# EAGLE design Battery_V2 (EAGLE 6.4)
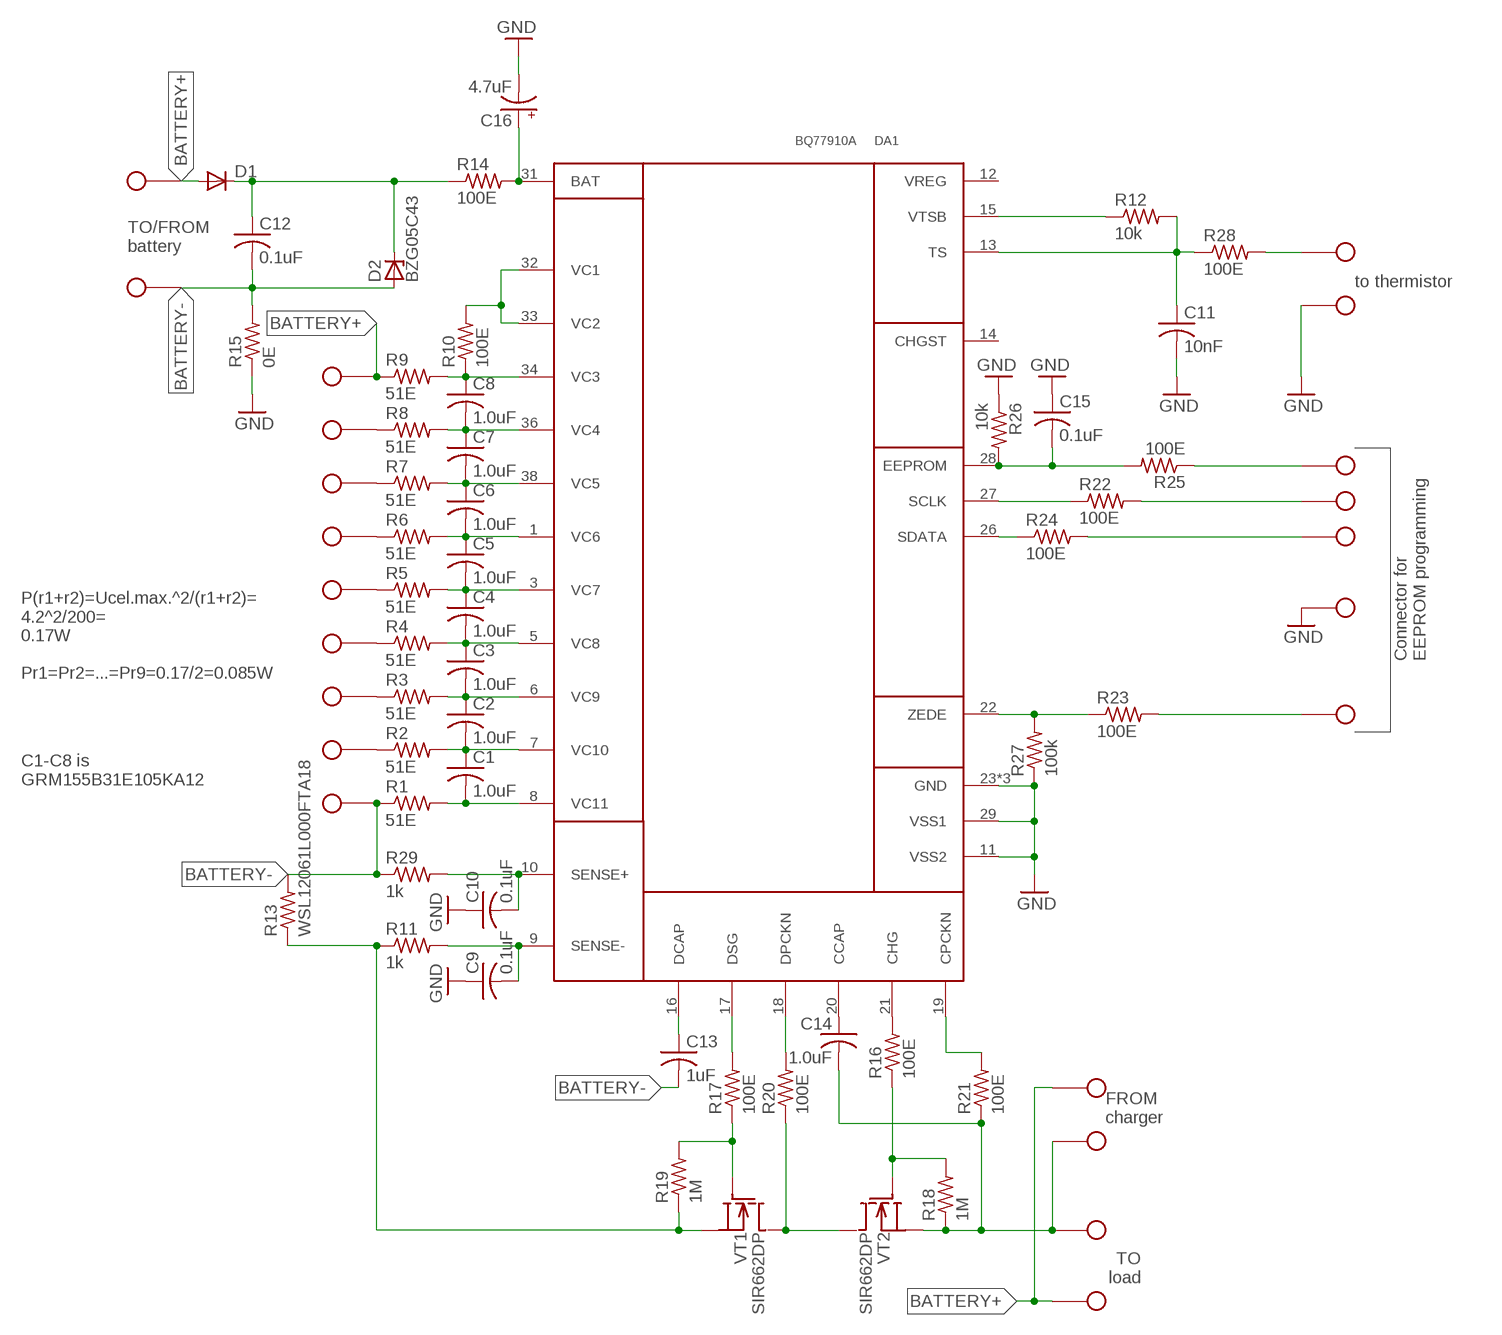
[diagram p0: schematic, sheet 1]

## Parts
C1  1.0uF  C-USC0402K  [C0402K]
C2  1.0uF  C-USC0402K  [C0402K]
C3  1.0uF  C-USC0402K  [C0402K]
C4  1.0uF  C-USC0402K  [C0402K]
C5  1.0uF  C-USC0402K  [C0402K]
C6  1.0uF  C-USC0402K  [C0402K]
C7  1.0uF  C-USC0402K  [C0402K]
C8  1.0uF  C-USC0402K  [C0402K]
C9  0.1uF  C-USC0201  [C0201]
C10  0.1uF  C-USC0201  [C0201]
C11  10nF  C-USC0201  [C0201]
C12  0.1uF  C-USC0402K  [C0402K]
C13  1uF  C-USC0402K  [C0402K]
C14  1.0uF  C-USC0603K  [C0603K]
C15  0.1uF  C-USC0402K  [C0402K]
C16  4.7uF  CPOL-USSMCP  [SMC_P]
D1  DIODE-DO-214AC  [DO-214AC]
D2  BZG05C43  ZENER-DIODEDO-214  [DO-214AC]
DA1  BQ77910A  [R-PDSO-G38]
R1  51E  R-US_M2012  [M2012]
R2  51E  R-US_M2012  [M2012]
R3  51E  R-US_M2012  [M2012]
R4  51E  R-US_M2012  [M2012]
R5  51E  R-US_M2012  [M2012]
R6  51E  R-US_M2012  [M2012]
R7  51E  R-US_M2012  [M2012]
R8  51E  R-US_M2012  [M2012]
R9  51E  R-US_M2012  [M2012]
R10  100E  R-US_R0402  [R0402]
R11  1k  R-US_R0201  [R0201]
R12  10k  R-US_R0201  [R0201]
R13  WSL12061L000FTA18  R-US_R1206  [R1206]
R14  100E  R-US_R0402  [R0402]
R15  0E  R-US_R0402  [R0402]
R16  100E  R-US_R0402  [R0402]
R17  100E  R-US_R0402  [R0402]
R18  1M  R-US_R0402  [R0402]
R19  1M  R-US_R0402  [R0402]
R20  100E  R-US_R0402  [R0402]
R21  100E  R-US_R0402  [R0402]
R22  100E  R-US_R0201  [R0201]
R23  100E  R-US_R0201  [R0201]
R24  100E  R-US_R0201  [R0201]
R25  100E  R-US_R0402  [R0402]
R26  10k  R-US_R0402  [R0402]
R27  100k  R-US_R0201  [R0201]
R28  100E  R-US_R0201  [R0201]
R29  1k  R-US_R0201  [R0201]
VT1  SIR662DP  [POWERPAK_SO8]
VT2  SIR662DP  [POWERPAK_SO8]
X1  SOLDER_HOLE24AWG  [SOLDER_HOLE_24]
X2  SOLDER_HOLE24AWG  [SOLDER_HOLE_24]
X3  SOLDER_HOLE24AWG  [SOLDER_HOLE_24]
X4  SOLDER_HOLE24AWG  [SOLDER_HOLE_24]
X5  SOLDER_HOLE24AWG  [SOLDER_HOLE_24]
X6  SOLDER_HOLE24AWG  [SOLDER_HOLE_24]
X7  SOLDER_HOLE24AWG  [SOLDER_HOLE_24]
X8  SOLDER_HOLE24AWG  [SOLDER_HOLE_24]
X9  SOLDER_HOLE24AWG  [SOLDER_HOLE_24]
X10  SOLDER_HOLE24AWG  [SOLDER_HOLE_24]
X11  SOLDER_HOLE24AWG  [SOLDER_HOLE_24]
X12  SOLDER_HOLE18AWG  [SOLDER_HOLE_18]
X13  SOLDER_HOLE18AWG  [SOLDER_HOLE_18]
X14  SOLDER_HOLE18AWG  [SOLDER_HOLE_18]
X15  SOLDER_HOLE18AWG  [SOLDER_HOLE_18]
X16  SOLDER_PAD  [SOLDER_PAD_SMD]
X17  SOLDER_PAD  [SOLDER_PAD_SMD]
X18  SOLDER_PAD  [SOLDER_PAD_SMD]
X19  SOLDER_PAD  [SOLDER_PAD_SMD]
X20  SOLDER_PAD  [SOLDER_PAD_SMD]
X21  SOLDER_HOLE24AWG  [SOLDER_HOLE_24]
X23  SOLDER_HOLE24AWG  [SOLDER_HOLE_24]

## Nets
BATTERY+: D1.A R9.1 X1.1 X11.1 X12.1 X15.1
BATTERY-: C12.2 C13.2 D2.A R1.1 R13.2 R15.2 R29.1 X9.1 X13.1
BATTERY_+: C12.1 D1.C D2.C R14.1
GND: C9.1 C10.1 C11.2 C15.1 C16.- DA1.11(VSS2) DA1.23(GND) DA1.24(GND) DA1.25(GND) DA1.29(VSS1) R15.1 R26.1 R27.1 X20.P$1 X21.1
N$1: C1.2 DA1.8(VC11) R1.2
N$2: C1.1 C2.2 DA1.7(VC10) R2.2
N$3: C2.1 C3.2 DA1.6(VC9) R3.2
N$4: C3.1 C4.2 DA1.5(VC8) R4.2
N$5: C4.1 C5.2 DA1.3(VC7) R5.2
N$6: C5.1 C6.2 DA1.1(VC6) R6.2
N$7: C6.1 C7.2 DA1.38(VC5) R7.2
N$8: C7.1 C8.2 DA1.36(VC4) R8.2
N$9: C8.1 DA1.34(VC3) R9.2 R10.1
N$10: DA1.32(VC1) DA1.33(VC2) R10.2
N$11: C10.2 DA1.10(SENSE+) R29.2
N$12: C9.2 DA1.9(SENSE-) R11.2
N$13: DA1.21(CHG) R16.2
N$14: R11.1 R13.1 R19.1 VT1.S1(S) VT1.S2(S) VT1.S3(S)
N$15: C16.+ DA1.31(BAT) R14.2
N$16: R2.1 X8.1
N$17: R3.1 X7.1
N$18: R4.1 X6.1
N$19: R5.1 X5.1
N$20: R6.1 X4.1
N$21: R7.1 X3.1
N$22: R8.1 X2.1
N$23: DA1.17(DSG) R17.2
N$24: R16.1 R18.2 VT2.G
N$25: R17.1 R19.2 VT1.G
N$26: R20.1 VT1.D VT2.D
N$27: C14.2 R18.1 R21.1 VT2.S1(S) VT2.S2(S) VT2.S3(S) X10.1 X14.1
N$28: C14.1 DA1.20(CCAP)
N$29: DA1.18(DPCKN) R20.2
N$30: DA1.19(CPCKN) R21.2
N$31: C13.1 DA1.16(DCAP)
N$32: DA1.22(ZEDE) R23.1 R27.2
N$33: DA1.26(SDATA) R24.1
N$34: DA1.27(SCLK) R22.1
N$35: C15.2 DA1.28(EEPROM) R25.2 R26.2
N$36: R24.2 X18.P$1
N$37: R22.2 X17.P$1
N$38: R25.1 X16.P$1
N$39: R23.2 X19.P$1
N$41: DA1.15(VTSB) R12.1
N$42: C11.1 DA1.13(TS) R12.2 R28.1
N$43: R28.2 X23.1
Unconnected: DA1.2 DA1.4 DA1.14(CHGST) DA1.30 DA1.35 DA1.37

## Notes on the sheet
- TO/FROM 
  battery
- to thermistor
- Connector for 
  EEPROM programming
- P(r1+r2)=Ucel.max.^2/(r1+r2)=
  4.2^2/200=
  0.17W
  
  Pr1=Pr2=...=Pr9=0.17/2=0.085W
- C1-C8 is
  GRM155B31E105KA12
- FROM
  charger
- TO
  load

## Power pins joined to a net without a drawn wire
VREG: DA1.12(VREG)

## Library data of the parts
C1-C15 = ForBattery:C-US: CAPACITOR, American symbol
C16 = ForBattery:CPOL-US: POLARIZED CAPACITOR, American symbol
D1 = ForBattery:DIODE-: DIODE
D2 = ForBattery:ZENER-DIODE: Z-Diode
DA1 = ForBattery:BQ77910A
R1-R29 = ForBattery:R-US_: RESISTOR, American symbol
VT1 VT2 = ForBattery:SIR662DP
X1-X15 X21 X23 = ForBattery:SOLDER_HOLE
X16-X20 = ForBattery:SOLDER_PAD

## Board
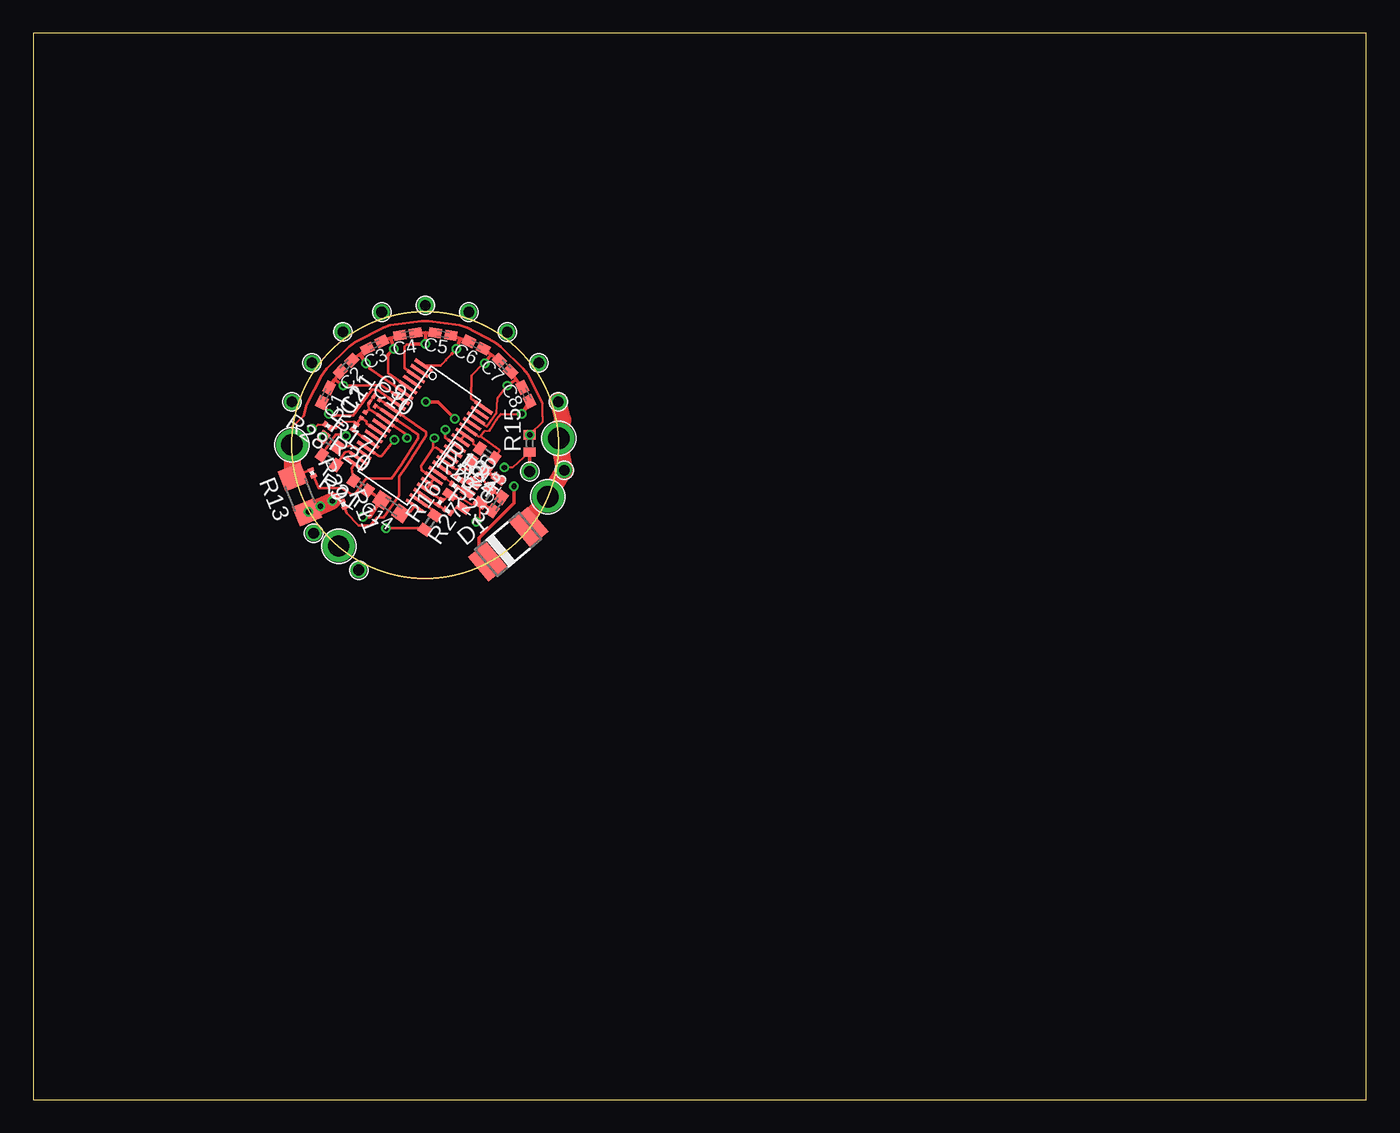
[diagram p1: board, top side]
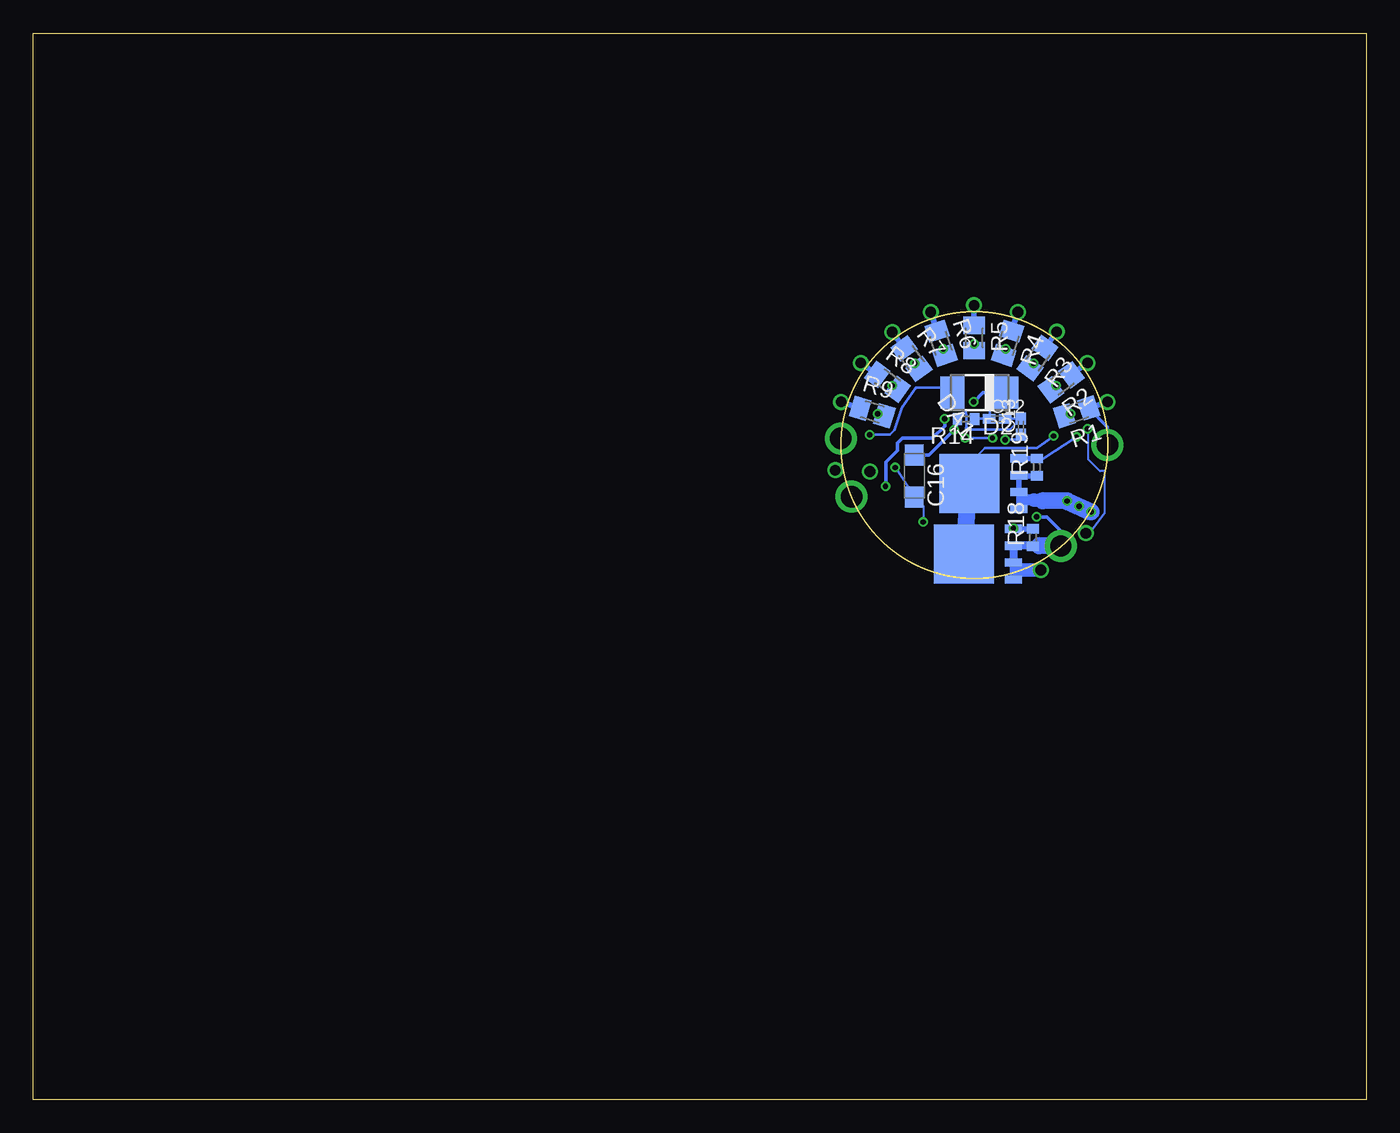
[diagram p2: board, bottom side, seen from below]

Size 100 x 80 mm. Coordinates in mm from the lower left corner, seen from the top.
Outline: 0,0 100,0 100,80 0,80 0,0
Outline: circle at 29.4,49.1 radius 10
Copper layers (1*16): Top 0.035mm / dielectric 1.5mm / Bottom 0.035mm
Design rules "default *": minimum track width 6mil, minimum drill 16mil, track to track 6mil, track to pad 6mil, pad to pad 6mil, via to via 6mil, smd to smd 6mil, copper to edge 10mil, drill to drill 8mil, minimum pad ring 6mil, minimum via ring 6mil, stop-mask expansion 4mil, vias tented up to drill 0mil, thermal gap 10mil

### Footprints (pad centres in the part's own frame; a part is rotated, then mirrored left to right if it is on the bottom)
C0402K = smd 0.925 x 0.74: 1 -0.6,0; 2 0.6,0
C0201 = smd 0.25 x 0.35: 1 -0.25,0; 2 0.25,0
C0603K = smd 1.05 x 1.08: 1 -0.875,0; 2 0.875,0
SMC_P = smd 1.6 x 1.4: + -1.575,0; - 1.575,0
DO-214AC = smd 1.8 x 2.4: A 2.025,0; C -2.025,0
R-PDSO-G38 = smd 0.25 x 1.55: 1 -4.5,-2.75; 2 -4,-2.75; 3 -3.5,-2.75; 4 -3,-2.75; 5 -2.5,-2.75; 6 -2,-2.75; 7 -1.5,-2.75; 8 -1,-2.75; 9 -0.5,-2.75; 10 0,-2.75; 11 0.5,-2.75; 12 1,-2.75; 13 1.5,-2.75; 14 2,-2.75; 15 2.5,-2.75; 16 3,-2.75; 17 3.5,-2.75; 18 4,-2.75; 19 4.5,-2.75; 20 4.5,2.75; 21 4,2.75; 22 3.5,2.75; 23 3,2.75; 24 2.5,2.75; 25 2,2.75; 26 1.5,2.75; 27 1,2.75; 28 0.5,2.75; 29 0,2.75; 30 -0.5,2.75; 31 -1,2.75; 32 -1.5,2.75; 33 -2,2.75; 34 -2.5,2.75; 35 -3,2.75; 36 -3.5,2.75; 37 -4,2.75; 38 -4.5,2.75
M2012 = smd 1.3 x 1.6: 1 -0.95,0; 2 0.95,0
R0402 = smd 0.7 x 0.9: 1 -0.65,0; 2 0.65,0
R0201 = smd 0.28 x 0.43: 1 -0.255,0; 2 0.255,0
R1206 = smd 1.6 x 1.803: 1 -1.422,0; 2 1.422,0
POWERPAK_SO8 = smd 4.52 x 4.42: D 3.715,0 | smd 1.27 x 0.61: G 0,-1.905; S1 0,1.905; S2 0,0.635; S3 0,-0.635
SOLDER_HOLE_24 = drill 0.8: 1 0,0
SOLDER_HOLE_18 = drill 1.6: 1 0,0
SOLDER_PAD_SMD = smd 1 x 0.6: P$1 0,0

### Placement (x,y rotation side)
C1  21.92,52.86 243 top
C2  23.47,55.04 225 top
C3  25.6,56.62 207 top
C4  28.09,57.43 189 top
C5  30.73,57.43 171 top
C6  33.22,56.62 153 top
C7  35.38,55.04 135 top
C8  36.96,52.91 117 top
C9  25.77,52.64 325 top
C10  25.44,52.17 325 top
C11  24.75,51.36 55 top
C12  27.69,51.08 0 bottom
C13  25.91,50.5 90 bottom
C14  26.86,44.48 145 top
C15  34.8,44.68 55 top
C16  33.91,46.79 270 bottom
D1  35.63,41.65 40 top
D2  29.01,53.04 180 bottom
DA1  28.95,49.81 235 top
R1  21.73,51.6 198 bottom
R2  22.89,53.82 216 bottom
R3  24.66,55.63 234 bottom
R4  26.9,56.74 252 bottom
R5  29.41,57.15 270 bottom
R6  31.9,56.74 288 bottom
R7  34.11,55.6 306 bottom
R8  35.92,53.85 324 bottom
R9  37.06,51.59 343 bottom
R10  34.05,48.48 145 top
R11  23.26,44.66 292 top
R12  24.11,50.47 55 top
R13  20.01,45.39 112 top
R14  30.02,51.07 180 bottom
R15  37.24,49.23 90 top
R16  29.75,43.3 55 top
R17  22.29,49.33 325 top
R18  24.99,42.16 90 bottom
R19  24.71,47.45 90 bottom
R20  22.19,47.98 325 top
R21  24.56,46.06 145 top
R22  31.96,46.6 325 top
R23  31.11,44.15 325 top
R24  31.59,46.07 325 top
R25  33.4,47.55 145 top
R26  33.9,45.31 55 top
R27  30.5,44.81 235 top
R28  22.1,50.54 145 top
R29  20.93,47.02 292 top
VT1  26.06,46.2 180 bottom
VT2  26.47,40.92 180 bottom
X1  39.4,52.35 0 top
X2  37.92,55.27 0 top
X3  35.56,57.58 0 top
X4  32.66,59.08 0 top
X5  29.41,59.59 0 top
X6  26.14,59.08 0 top
X7  23.22,57.61 0 top
X8  20.9,55.27 0 top
X9  19.4,52.34 0 top
X10  24.41,39.73 0 top
X11  39.83,47.22 0 top
X12  39.42,49.61 0 top
X13  19.41,49.12 0 top
X14  22.91,41.53 0 top
X15  38.61,45.24 0 top
X16  34.89,46.58 145 top
X17  33.07,46.23 325 top
X18  32.58,45.55 325 top
X19  32.24,44.38 145 top
X20  31.26,45.4 325 top
X21  37.24,47.12 0 top
X23  21.03,42.49 0 top

### Tracks (layer width: path | path; a pad name or v marks a point on that pad's centre or on a via)
BATTERY+
  Top 1.016: D1.A 37.18,43.81 X15.1
  Top 1.27: X15.1 X11.1 X12.1 39.73,51.03 X1.1
  Bottom 0.406: X1.1 R9.1
BATTERY-  (via drill 0.41)
  Top 0.152: R15.2 38.23,50.87 38.23,51.23 38.2,51.26 38.2,52.22
  Top 0.203: R29.1 R13.2 19.43,50.49 20.3,51.28 20.52,52.15 21.61,54.3 22.02,54.84 23.7,56.49 24.16,56.84 26.26,57.91 26.77,58.09 29.13,58.42 29.67,58.42 31.98,58.09 32.54,57.91 34.59,56.84 35.05,56.49 36.73,54.84 37.11,54.38 38.2,52.22 | v37.24,49.89 37.22,49.88 R15.2
  Top 1.27: R13.2 19.47,49.05 X13.1
  Bottom 0.203: C13.2 26.26,50.74 | 26.26,50.74 26.74,50.27 29.95,50.27 | 29.95,50.27 30,50.27 | 30,50.39 30.02,50.39 | 30,50.39 29.95,50.34 29.95,50.27 | 30,50.39 29.95,50.47 30,50.52 30,51.41 30.02,51.44 30.05,51.51 30.05,51.61 30.28,51.84 31.04,51.84 31.04,52.96 D2.A 31.4,53.42 33.78,53.42 34.85,51.92 35.38,50.24 35.74,49.89 v37.24,49.89 | C12.2 26.26,51.08 26.26,50.74
  Bottom 0.254: X13.1 19.41,50.47 R1.1
  Bottom 0.406: X9.1 R1.1
BATTERY_+  (via drill 0.41)
  Top 0.254: D1.C 33.43,41 33.43,42.11 36.07,44.76 v36.07,46 | v31.62,51.08 30.35,52.35 v29.44,52.35
  Bottom 0.203: 26.98,52.65 D2.C 28.22,53.03 28.22,51.08 C12.1 R14.1
  Bottom 0.254: v36.07,46 36.04,46.02 36.04,47.83 35.18,48.69 35.18,49.25 34.8,49.63 32.54,49.63 31.62,50.55 v31.62,51.08 | v29.44,52.35 28.74,53.04 D2.C
GND  (via drill 0.41)
  Top 0.152: X20.P$1 31.73,45.09 32.08,45.19 32.87,44.65 R26.1 33.53,43.64 v33.22,43.33 | R15.1 35.96,47.42 v35.33,47.42
  Top 0.203: C9.1 C10.1 25.19,52.23 25.13,52.15 25.19,51.8 | 25.19,51.8 25.28,51.73 25.36,51.7 26.39,50.98 DA1.11 27.89,49.96 v28.04,49.63 | C11.2 25.19,51.8 | X20.P$1 31.24,45.39 30.91,45.06 30.73,45.06 R27.1 30.58,45.01 DA1.23 DA1.24 DA1.25 29.13,47.24 29.08,47.52 30,48.9 | DA1.29 30.2,48.92 30,48.9 | v30.07,49.63 30,49.48 30,48.9
  Top 0.254: R26.1 C15.1 | X21.1 R15.1
  Bottom 0.152: v35.33,47.42 33.99,45.39 C16.- 33.22,44.52 v33.22,43.33
  Bottom 0.203: v28.04,49.63 v30.07,49.63
N$1  (via drill 0.41)
  Top 0.203: DA1.8 25.78,53.26 25.4,53.26 24,51.31 R1.2
  Top 0.254: v22.17,51.46 C1.2 | 22.3,51.54 22.3,51.49 v22.17,51.46 | R1.2 22.33,51.3 v22.17,51.46
  Bottom 0.254: R1.2 v22.17,51.46
N$2  (via drill 0.41)
  Top 0.203: DA1.7 26.11,53.62 25.17,53.62 25.12,53.57 v23.27,53.57
  Top 0.254: C1.1 22.62,54.03 | 22.62,54.03 C2.2 | 22.62,54.03 v23.27,53.57 23.32,53.62
  Bottom 0.254: R2.2 v23.27,53.57
N$3  (via drill 0.41)
  Top 0.203: DA1.6 26.31,54.08 R3.2 v24.94,55.24
  Top 0.254: C2.1 24.5,55.91 | 24.5,55.91 C3.2 | 24.5,55.91 v24.94,55.24 25.2,54.99
  Bottom 0.254: R3.2 v24.94,55.24
N$4  (via drill 0.41)
  Top 0.203: DA1.5 26.62,54.51 26.62,55.8
  Top 0.254: C3.1 26.82,57.12 | 26.82,57.12 C4.2 | v27.05,56.31 26.82,57.12 | 26.95,56.24 v27.05,56.31 | 26.62,55.8 26.62,55.88 v27.05,56.31
  Bottom 0.254: R4.2 v27.05,56.31
N$5  (via drill 0.41)
  Top 0.203: DA1.3 27.86,54.86 27.86,56.49 28.02,56.64 28.52,56.64 28.55,56.67
  Top 0.254: C4.1 29.42,57.53 | 29.42,57.53 C5.2 | 29.42,57.53 v29.41,56.69 29.39,56.67 28.55,56.67
  Bottom 0.254: R5.2 v29.41,56.69
N$6  (via drill 0.41)
  Top 0.203: DA1.1 30.54,55.08 30.96,55.5 30.96,55.52 v31.75,56.31
  Top 0.254: 32.01,57.11 C5.1 31.22,57.43 | 32.01,57.11 C6.2 | 32.01,57.11 v31.75,56.31 31.42,55.98
  Bottom 0.254: R6.2 v31.75,56.31
N$7  (via drill 0.41)
  Top 0.203: DA1.38 32.84,52.58 32.87,54.33 33.78,55.24 v33.86,55.24
  Top 0.254: C6.1 34.35,55.9 | 34.35,55.9 C7.2 | v33.86,55.24 34.35,55.9 | 33.76,55.04 33.76,55.17 v33.86,55.24 | 33.81,55.19 v33.86,55.24
  Bottom 0.254: R7.2 v33.86,55.24
N$8  (via drill 0.41)
  Top 0.152: v35.56,53.57 34.82,52.6 34.75,51.51 34.06,50.49 DA1.36
  Top 0.254: C7.1 36.22,54.03 | 36.22,54.03 C8.2 | v35.56,53.57 36.22,54.03 | v35.56,53.57 | 35.53,53.54 v35.56,53.57
  Bottom 0.152: R8.2 35.43,53.57 v35.56,53.57
  Bottom 0.254: 35.28,53.29 v35.56,53.57
N$9  (via drill 0.41)
  Top 0.152: DA1.34 33.43,49.73 33.55,49.73 | v36.65,51.44 35.08,51.44 34.77,51 34.42,50.47 34.24,50.19 33.86,50.16 33.55,49.73 | R10.1 35,48.69 33.55,49.73
  Top 0.254: v36.65,51.44 C8.1
  Bottom 0.254: R9.2 v36.65,51.44
N$10
  Top 0.152: R10.2 33.05,49.15 33.05,49.38 DA1.33
  Top 0.203: DA1.32 DA1.33
N$11
  Top 0.203: C10.2 25.75,52.05 DA1.10 28.85,49.89 28.85,49.58 28.83,49.55 27.58,47.6 26.87,46.58 24.97,46.58 24.87,46.46 24.13,45.41 23.85,45.41 23.11,45.87 21.41,45.87 R29.2
N$12
  Top 0.203: C9.2 DA1.9 29.46,50.06 29.46,49.84 27.91,47.42 27.46,46.74 27.46,45.31 26.26,43.66 25.81,43.66 25.27,43.08 24.41,43.08 23.52,44.02 R11.2
N$13
  Top 0.203: R16.2 30.06,44.15 DA1.21
N$14  (via drill 0.41)
  Top 0.203: R11.1 v22.43,44.91
  Top 1.27: R13.1 v22.43,44.91
  Bottom 0.406: 25.96,44.96 26.06,44.96 | VT1.S1 26.06,44.96 | 26.06,44.96 VT1.S2 VT1.S3 26.06,46.8 R19.1
  Bottom 0.61: 25.73,44.98 25.96,44.96
  Bottom 0.813: 24.92,44.98 25.73,44.98
  Bottom 1.016: 24.26,44.93 24.92,44.98
  Bottom 1.27: v22.43,44.91 24.26,44.93
N$15  (via drill 0.41)
  Top 0.203: DA1.31 30.91,49.66 v30.91,50.27
  Bottom 0.203: R14.2 30.71,50.27 v30.91,50.27
  Bottom 0.254: C16.+ 32.82,48.36 v30.91,50.27
N$16
  Bottom 0.406: X8.1 R2.1
N$17
  Bottom 0.406: X7.1 R3.1
N$18
  Bottom 0.406: X6.1 R4.1
N$19
  Bottom 0.406: X5.1 R5.1
N$20
  Bottom 0.406: X4.1 R6.1
N$21
  Bottom 0.406: X3.1 R7.1
N$22
  Bottom 0.406: X2.1 R8.1
N$23
  Top 0.203: DA1.17 24.69,48.51 23.87,49.09 23.24,48.98 23.16,48.86 23.07,48.89 23.02,49.22 22.99,49.22 22.83,48.98 R17.2
N$24  (via drill 0.41)
  Top 0.203: R16.1 29.21,42.88 v26.47,42.88
  Bottom 0.203: v26.47,42.88 26.32,42.81
  Bottom 0.406: R18.2 25.53,42.81 26.32,42.81 VT2.G
N$25  (via drill 0.41)
  Top 0.203: v21.74,49.71 R17.1
  Bottom 0.203: VT1.G 24.21,48.11 R17.1 v21.74,49.71
  Bottom 0.406: R19.2 26.06,48.1 VT1.G
N$26  (via drill 0.41)
  Top 0.203: R20.1 21.92,48.79 22.63,49.81 22.68,49.89 23.32,49.89 23.42,49.78 v23.44,49.78
  Bottom 0.203: v23.44,49.78 24.71,48.87 28.6,48.87 29.77,47.7 VT1.D
  Bottom 1.27: VT2.D VT1.D
N$27  (via drill 0.41)
  Top 0.203: R21.1 25.13,45.7 C14.2
  Top 0.254: 25.13,45.7 26.09,45.03 25.22,43.71 v24.74,43.71
  Bottom 0.152: 25.91,39.73 26.47,39.73 26.47,39.75
  Bottom 0.254: v24.74,43.71 23.95,43.71 22.91,42.67 X14.1
  Bottom 0.406: R18.1 26.47,41.51 VT2.S3
  Bottom 0.61: 24.54,41.55 VT2.S3 VT2.S2 26.47,39.75 VT2.S1
  Bottom 1.016: X10.1 25.91,39.73
  Bottom 1.27: X14.1 24.54,41.55
N$28
  Top 0.203: C14.1 28.31,44.11 DA1.20
N$29
  Top 0.203: DA1.18 23.69,48.62 23.61,48.63 23.44,48.6 23.37,48.53 23.16,48.24 R20.2
N$30
  Top 0.203: R21.2 23.86,47.35 DA1.19
N$31  (via drill 0.41)
  Top 0.203: DA1.16 25.93,48.28 26.14,48.28 v27.1,49.51
  Bottom 0.203: v27.1,49.51 25.91,49.51 C13.1
N$32
  Top 0.203: DA1.22 30.3,44.59 R27.2 30.82,44.28 R23.1
N$33
  Top 0.152: DA1.26 30.96,46.58 R24.1
N$34
  Top 0.152: R22.1 31.34,46.91 DA1.27
N$35
  Top 0.152: R26.2 33.91,46.33 33.3,46.74 32.46,47.32 | 32.46,47.32 R25.2 | DA1.28 31.7,47.3 32.46,47.32
  Top 0.254: R26.2 C15.2
N$36
  Top 0.152: R24.2 32.13,45.92 X18.P$1
N$37
  Top 0.152: R22.2 32.77,46.45 X17.P$1
N$38
  Top 0.254: R25.1 X16.P$1
N$39
  Top 0.152: X19.P$1 31.7,44.38 R23.2
N$40  (via drill 0.41)
  Bottom 1.27: 22.45,44.91 v20.62,44.09
N$41
  Top 0.203: R12.1 23.97,50.25 DA1.15
N$42
  Top 0.152: R28.1 22.76,50.39 23.24,50.88 24.06,50.88 R12.2
  Top 0.203: R12.2 C11.1 24.99,50.88 25.02,50.73 DA1.13
N$43  (via drill 0.41)
  Top 0.152: v20.9,50.32 21.03,50.32 21.36,50.65 21.86,50.65 R28.2
  Bottom 0.152: X23.1 20.52,42.8 19.61,43.99 19.61,47.14 19.96,47.14 20.85,48.03 20.85,50.27 v20.9,50.32
N$44  (via drill 0.41)
  other vias: 21.54,44.5

### Text on the board
Document: cell4+ | cell5+ | cell3+ | cell6+ | cell2+ | cell7+ | cell1+ | battery-, / cell1- | battery+, / cell8+ | charger + | thermistor + | load + | load - | charger - | supply | sclk | sdata | zede | GND